# EAGLE design Serial_CAN_FD (EAGLE 6.4)
DESCRIPTION: microOBD 200 OBD-II Module; HW_REV: 1.4; PCB_REV: C; PCB_SPEC1: Layer Count: 4; PCB_SPEC2: Size: 1.3" x 0.59"; PCB_SPEC3: Finish Thickness: 0.049" - 0.052"; PCB_SPEC4: Copper Weight: 1oz; TITLE: STM1120

## Sheet 1 of 2
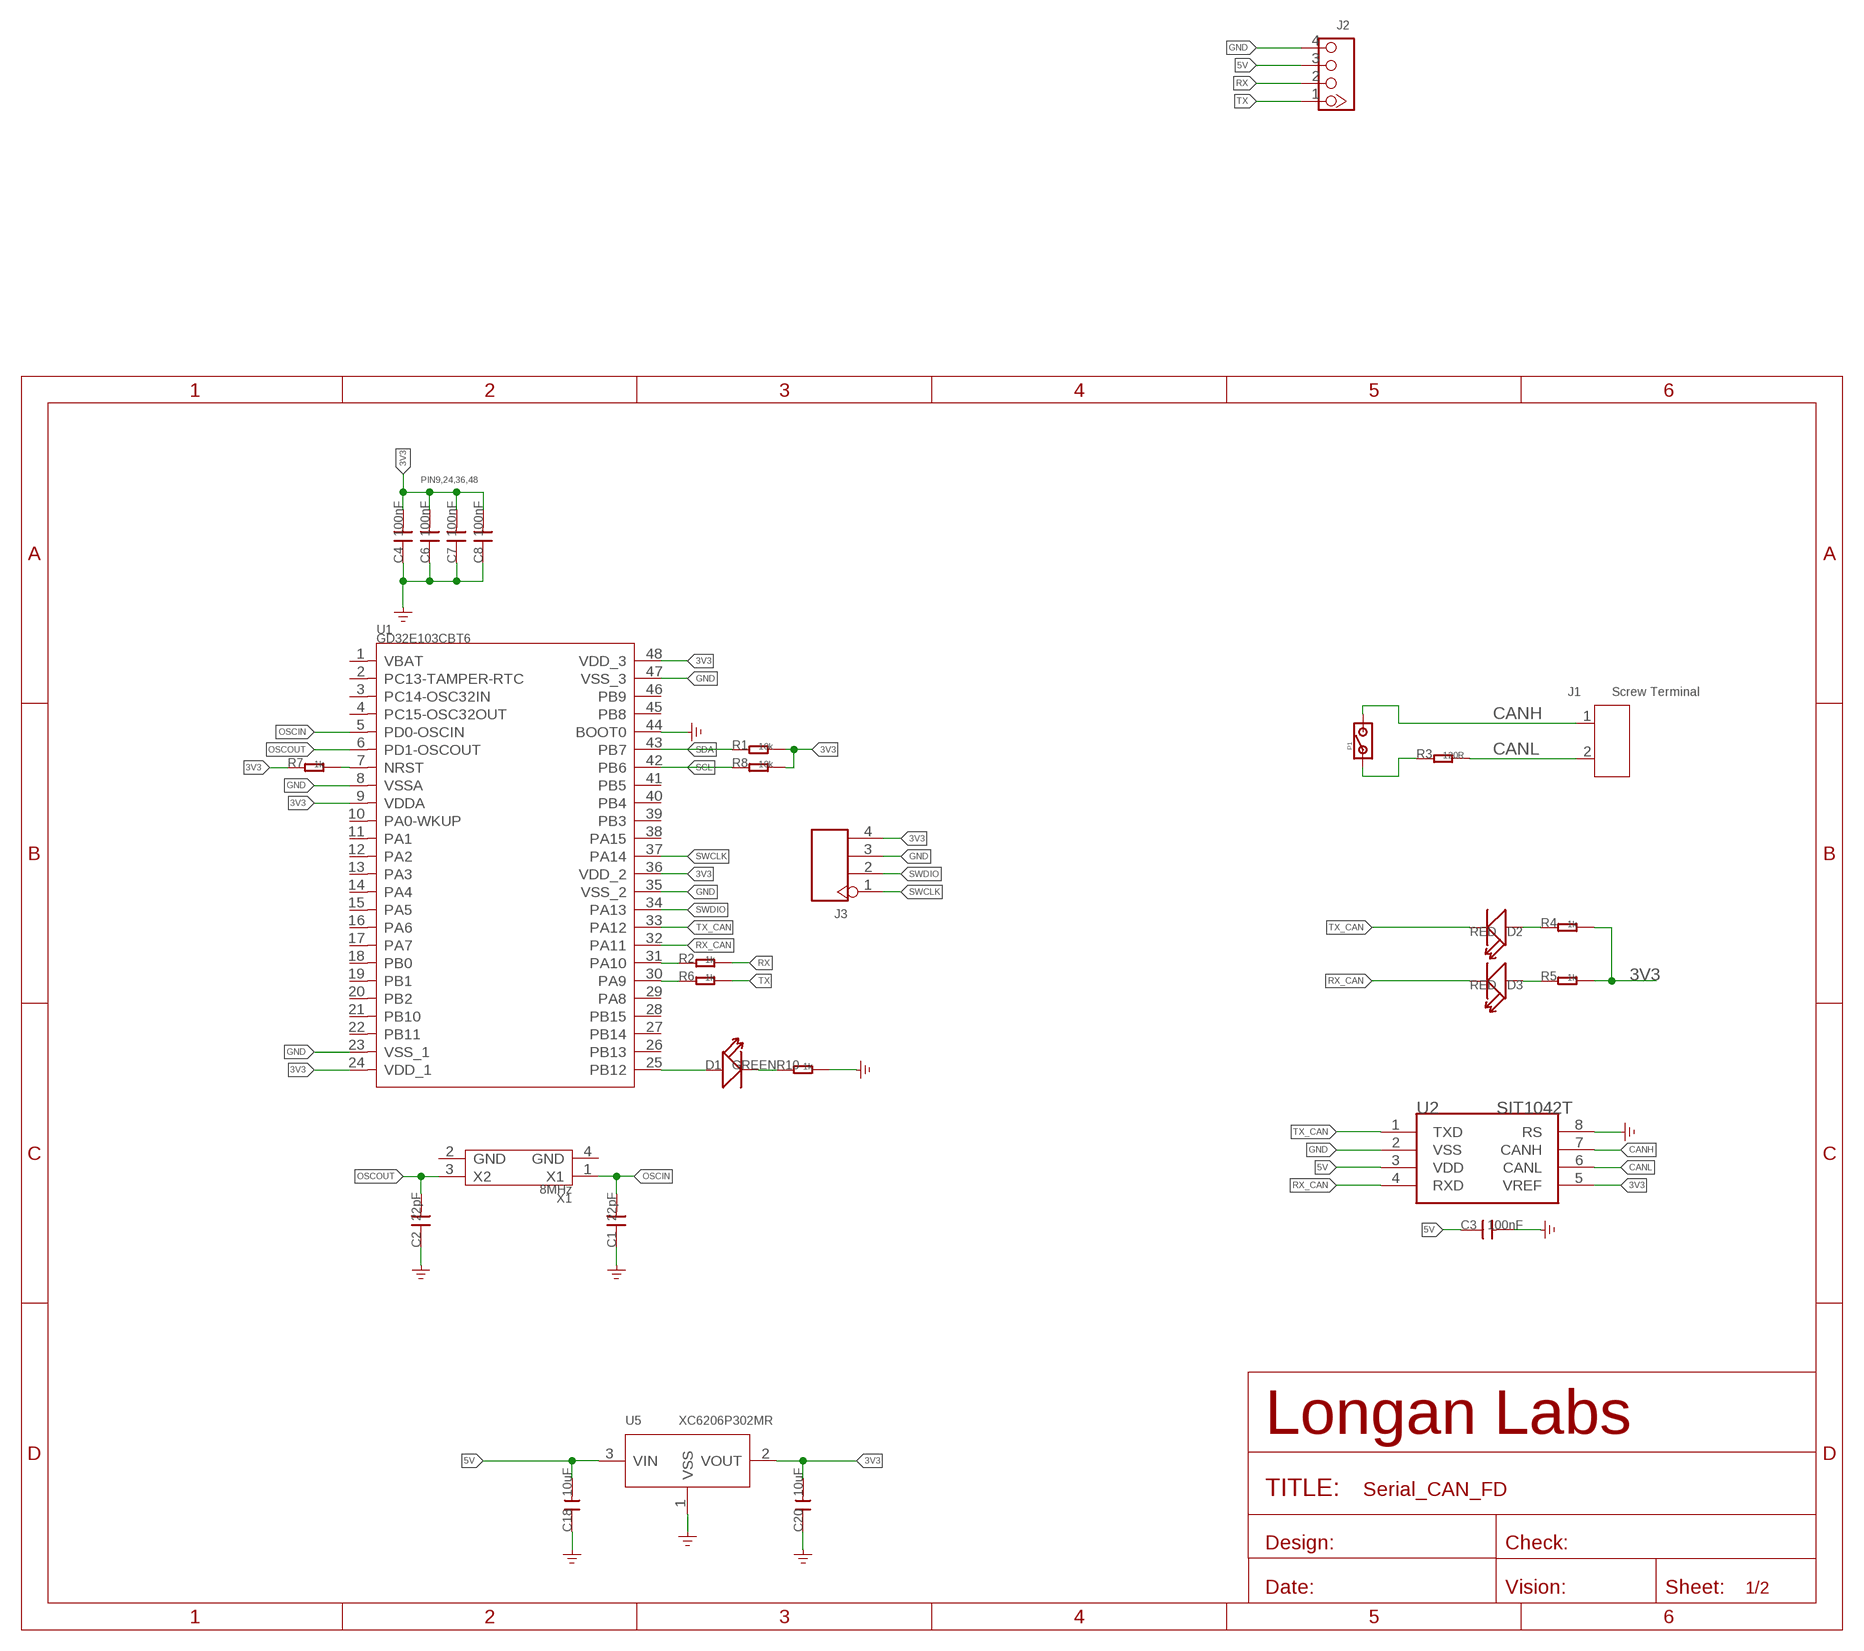
[diagram p0: schematic, sheet 1]

### Parts
C1  22pF  C-0603  [0603]
C2  22pF  C-0603  [0603]
C3  100nF  C-0603  [0603]
C4  100nF  C-0603  [0603]
C6  100nF  C-0603  [0603]
C7  100nF  C-0603  [0603]
C8  100nF  C-0603  [0603]
C18  10uF  CAP-0603  [C0603]
C20  10uF  CAP-0603  [C0603]
D1  GREEN  LED'0603'  [LED-0603]
D2  RED  LED'0603'  [LED-0603]
D3  RED  LED'0603'  [LED-0603]
J1  Screw Terminal  SCREW-TERMINAL-2P'3.5'  [2P-3.5]
J2  320110033  GROVE-CONNECTOR-DIP-320110033  [HW4-2.0]
J3  HEADER-4P-65/35MIL  [H4-2.54]
P1  PAD-JUMPER-2P  [2P-SMD-1.78X1.27]
R1  10k  R-0603  [0603]
R2  1k  R-0603  [0603]
R3  120R  R-0603  [0603]
R4  1k  R-0603  [0603]
R5  1k  R-0603  [0603]
R6  1k  R-0603  [0603]
R7  1k  R-0603  [0603]
R8  10k  R-0603  [0603]
R10  1k  R-0603  [0603]
U1  GD32E103CBT6  MCU-GD32E103CBT6  [LQFP48]
U2  SIT1042T  MCP2551-SOIC8  [SOIC8-6.0]
U5  XC6206P302MR  PMIC-XC6206PMR  [SOT-23]
X1  8MHz  CRYSTAL-4P-3225  [X4-SMD-3.2X2.5X0.7MM]

### Nets
3V3: C4.2 C6.2 C7.2 C8.2 C20.2 J3.4 R1.2 R4.2 R5.2 R7.1 R8.2 U1.9(VDDA) U1.24(VDD_1) U1.36(VDD_2) U1.48(VDD_3) U2.5(VREF) U5.2(VOUT)
5V: C3.1 C18.2 J2.3 U2.3(VDD) U5.3(VIN)
CANH: J1.1 P1.2 U2.7(CANH)
CANL: J1.2 R3.2 U2.6(CANL)
GND: C1.1 C2.1 C3.2 C4.1 C6.1 C7.1 C8.1 C18.1 C20.1 J2.4 J3.3 R10.2 U1.8(VSSA) U1.23(VSS_1) U1.35(VSS_2) U1.44(BOOT0) U1.47(VSS_3) U2.2(VSS) U2.8(RS) U5.1(VSS) ; supply symbol labelled GND_POWER
N$1: P1.1 R3.1
N$2: D2.+ R4.1
N$3: R2.1 U1.31(PA10)
N$4: R6.1 U1.30(PA9)
N$5: D1.+ U1.25(PB12)
N$6: R7.2 U1.7(NRST)
N$8: D1.- R10.1
N$15: D3.+ R5.1
OSCIN: C1.2 U1.5(PD0-OSCIN) X1.1(X1)
OSCOUT: C2.2 U1.6(PD1-OSCOUT) X1.3(X2)
RX: J2.2 R2.2
RX_CAN: D3.- U1.32(PA11) U2.4(RXD)
SCL: R8.1 U1.42(PB6)
SDA: R1.1 U1.43(PB7)
SWCLK: J3.1 U1.37(PA14)
SWDIO: J3.2 U1.34(PA13)
TX: J2.1 R6.2
TX_CAN: D2.- U1.33(PA12) U2.1(TXD)
Unconnected: U1.1(VBAT) U1.2(PC13-TAMPER-RTC) U1.3(PC14-OSC32IN) U1.4(PC15-OSC32OUT) U1.10(PA0-WKUP) U1.11(PA1) U1.12(PA2) U1.13(PA3) U1.14(PA4) U1.15(PA5) U1.16(PA6) U1.17(PA7) U1.18(PB0) U1.19(PB1) U1.20(PB2) U1.21(PB10) U1.22(PB11) U1.26(PB13) U1.27(PB14) U1.28(PB15) U1.29(PA8) U1.38(PA15) U1.39(PB3) U1.40(PB4) U1.41(PB5) U1.45(PB8) U1.46(PB9) X1.2(GND) X1.4(GND)

### Notes on the sheet
- PIN9,24,36,48

## Sheet 2 of 2

## Library data of the parts
C1-C4 C6-C8 = Discrete:C*: Ceramic Capacitors
C18 C20 = Discrete-new:CAP: Ceramic Capacitors
D1-D3 = Discrete:LED*
J1 = Connector-new:SCREW-TERMINAL-2P: 2P-3.5:320110028;2P-5.0:320110031
J2 = Connector-new:GROVE-CONNECTOR-DIP
J3 = Connector-new:HEADER-4P
P1 = Discrete:PAD-JUMPER-2P
R1-R8 R10 = Discrete:R*
U1 = Longan-IC:MCU-GD32E103CBT6
U2 = IC:MCP2551: High-Speed CAN Transceiver http://ww1.microchip.com/downloads/en/devicedoc/21667f.pdf
U5 = IC-new:PMIC-XC6206P: LOW ESR Cap.Compatible Positive Voltage Regulators
X1 = Discrete-new:CRYSTAL-4P

## Net classes
3 usbvcc: width 0.152 mm, drill 0.152 mm, clearance 0.152 mm

## Board
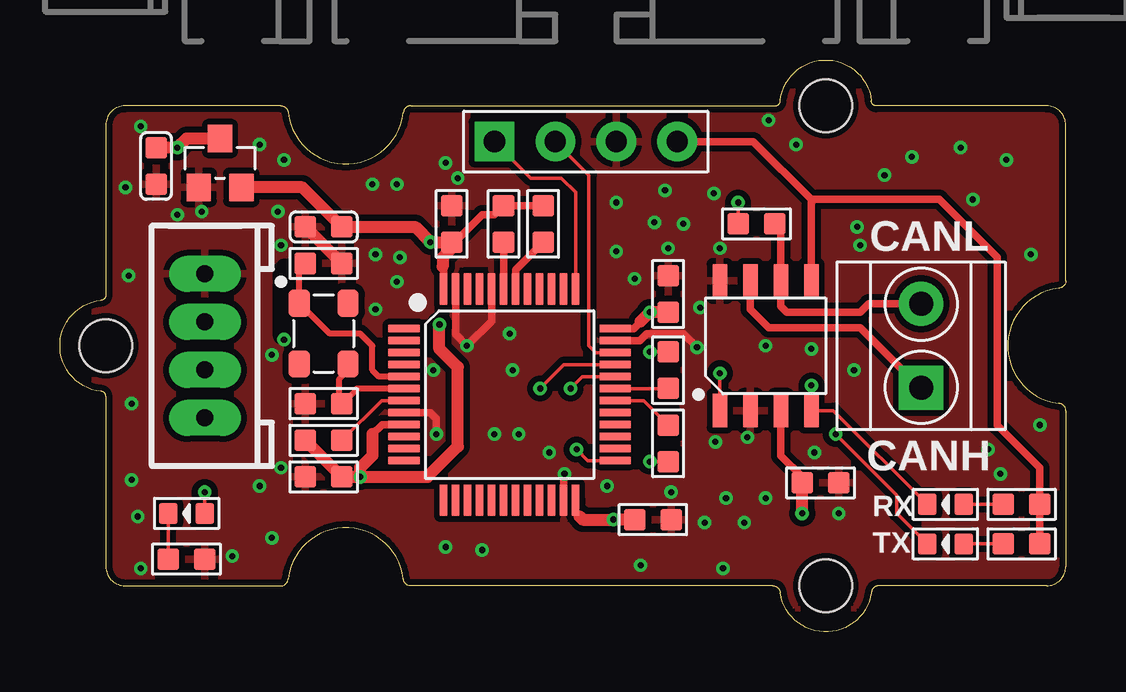
[diagram p1: board, top side]
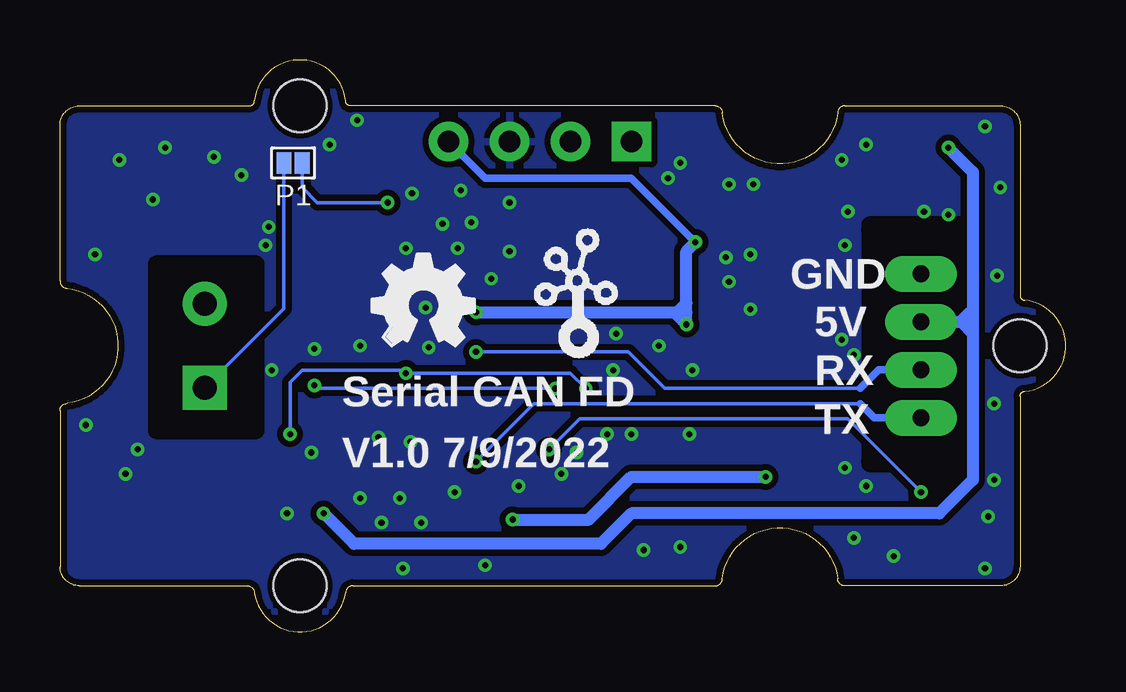
[diagram p2: board, bottom side, seen from below]

Size 41.91 x 23.83 mm. Coordinates in mm from the lower left corner, seen from the top.
Copper layers (1*16): Top 0.035mm / dielectric 1.5mm / Bottom 0.035mm
Design rules "SeeedStudio_2layer_DRU_no_angle_20140221 *": minimum track width 6mil, minimum drill 10mil, track to track 6mil, track to pad 6mil, pad to pad 6mil, via to via 6mil, smd to smd 0mil, copper to edge 10mil, drill to drill 10mil, minimum pad ring 10mil, minimum via ring 6mil, stop-mask expansion 2mil, vias tented up to drill 25mil, thermal gap 10mil
tRestrict: area 9.2,12.3 to 9.8,15.2
bRestrict: area 4,7.1 to 8.2,16.7; area 33.7,8.4 to 37.9,15.4

### Footprints (pad centres in the part's own frame; a part is rotated, then mirrored left to right if it is on the bottom)
0603 = smd 0.889 x 0.889: 1 -0.762,0; 2 0.762,0
C0603 = smd 0.889 x 0.889: 1 -0.762,0; 2 0.762,0
LED-0603 = smd 0.762 x 0.889: + -0.762,0; - 0.762,0
2P-3.5 = drill 1 pad 1.85 square: 1 -1.75,0 | drill 1 pad 1.85: 2 1.75,0
HW4-2.0 = drill 0.7 pad 1.5 long: 1 -3,0; 2 -1,0; 3 1,0; 4 3,0
H4-2.54 = drill 0.889 pad 1.651 square: 1 0,3.81 | drill 0.889 pad 1.651: 2 0,1.27; 3 0,-1.27; 4 0,-3.81
2P-SMD-1.78X1.27 = smd 0.889 x 0.61: 1 0,0.381; 2 0,-0.381
LQFP48 = smd 1.3 x 0.3: 1 -4.4,2.75; 2 -4.4,2.25; 3 -4.4,1.75; 4 -4.4,1.25; 5 -4.4,0.75; 6 -4.4,0.25; 7 -4.4,-0.25; 8 -4.4,-0.75; 9 -4.4,-1.25; 10 -4.4,-1.75; 11 -4.4,-2.25; 12 -4.4,-2.75; 25 4.4,-2.75; 26 4.4,-2.25; 27 4.4,-1.75; 28 4.4,-1.25; 29 4.4,-0.75; 30 4.4,-0.25; 31 4.4,0.25; 32 4.4,0.75; 33 4.4,1.25; 34 4.4,1.75; 35 4.4,2.25; 36 4.4,2.75 | smd 0.3 x 1.3: 13 -2.75,-4.4; 14 -2.25,-4.4; 15 -1.75,-4.4; 16 -1.25,-4.4; 17 -0.75,-4.4; 18 -0.25,-4.4; 19 0.25,-4.4; 20 0.75,-4.4; 21 1.25,-4.4; 22 1.75,-4.4; 23 2.25,-4.4; 24 2.75,-4.4; 37 2.75,4.4; 38 2.25,4.4; 39 1.75,4.4; 40 1.25,4.4; 41 0.75,4.4; 42 0.25,4.4; 43 -0.25,4.4; 44 -0.75,4.4; 45 -1.25,4.4; 46 -1.75,4.4; 47 -2.25,4.4; 48 -2.75,4.4
SOIC8-6.0 = smd 0.6 x 1.4: 1 -1.905,-2.7; 2 -0.635,-2.7; 3 0.635,-2.7; 4 1.905,-2.7; 5 1.905,2.7; 6 0.635,2.7; 7 -0.635,2.7; 8 -1.905,2.7
GROVE-TEST-PLATFORM = hole 2.2: -10,-10; -10,10; 20,0
SOT-23 = smd 1.016 x 1.143: 1 -0.889,-1.016; 2 0.889,-1.016; 3 0,1.016
X4-SMD-3.2X2.5X0.7MM = smd 1.143 x 0.889: 1 -1.27,-1.016; 2 1.27,-1.016; 3 1.27,1.016; 4 -1.27,1.016

### Placement (x,y rotation side)
C1  10.99,15.35 180 top
C2  10.99,9.51 0 top
C3  31.69,6.21 0 top
C4  10.99,6.46 0 top
C6  24.7,4.68 180 top
C7  25.34,14.08 270 top
C8  16.32,17 270 top
C18  4,19.41 90 top
C20  10.99,16.87 0 top
D1  5.27,4.94 180 top
D2  36.89,3.67 180 top
D3  36.89,5.32 180 top
J1  35.88,11.92 90 top
J2  6.03,11.92 90 top
J3  21.91,20.43 90 top
P1  32.2,19.54 270 bottom
R1  18.48,17 90 top
R2  25.34,10.91 90 top
R3  29.02,17 0 top
R4  40.07,3.67 0 top
R5  40.07,5.32 0 top
R6  25.34,7.86 270 top
R7  10.99,7.98 0 top
R8  20.13,17 90 top
R10  5.27,3.03 0 top
U1  18.73,9.89 0 top
U2  29.4,11.92 0 top
U3  [GROVE-TEST-PLATFORM]  21.91,11.92 180 top
U5  6.67,19.54 0 top
U$5  [OSHW_FILLX150_NOTEXT]  28.89,11.92 0 bottom
U$9  [GROVE-SILK-SMALL]  22.54,11.29 0 bottom
X1  10.99,12.43 270 top

### Tracks (layer width: path | path; a pad name or v marks a point on that pad's centre or on a via)
3V3  (via drill 0.25 pad 0.51)
  Top 0.305: R4.2 R5.2 40.83,6.84 39.05,8.62 39.05,15.6 36.64,18.02 31.43,18.02 31.31,17.89 | U1.9 13.42,8.64 13.02,8.24 | U1.48 15.98,15.18 15.94,15.22 | U1.36 23.9,12.64 24.19,12.94 | U1.24 21.48,4.98 21.65,4.81 | 16.45,16.24 17.59,17.38 18.1,17.38 R1.2 R8.2 | U2.5 31.31,17.89 | 31.31,17.89 31.31,18.02 28.89,20.43 J3.4
  Top 0.508: 13.02,8.24 13.02,7.35 12.51,6.84 v12.51,6.46 | v12.51,6.46 C4.2 R7.1 | C8.2 16.32,15.99 15.94,15.6 15.94,15.22 | C8.2 16.45,16.24 | C8.2 v15.43,16.24 14.8,16.87 13.78,16.87 C20.2 10.1,18.53 U5.2 | 24.19,12.94 v24.58,13.32 C7.2 | 21.65,4.81 21.78,4.68 v23.05,4.68 C6.2 | v12.51,6.46 15.3,6.46 16.57,7.73 16.57,11.03 15.81,11.79 v15.81,12.81
  Bottom 0.305: J3.4 24.19,18.91 18.1,18.91 v15.43,16.24
  Bottom 0.508: v24.58,13.32 16.32,13.32 | 16.19,13.32 15.81,13.32 | 15.81,13.32 v15.81,12.81 16.32,13.32 | 15.81,13.32 15.81,13.7 | 15.81,13.7 15.81,15.86 v15.43,16.24 | 16.32,13.32 16.19,13.32 | 16.19,13.32 15.81,13.7 | v23.05,4.68 19.88,4.68 18.1,6.46 v12.51,6.46
5V  (via drill 0.25 pad 0.51)
  Top 0.305: C3.1 30.93,6.46 30.04,7.35 U2.3
  Top 0.508: C18.2 v4.89,20.18 5.27,20.56 U5.3 | v30.93,4.94 C3.1
  Bottom 0.508: J2.3 5.84,12.92 4.4,12.92 | v4.89,20.18 3.87,19.16 3.87,12.43 | 4.4,12.92 4,13.32 | 3.87,12.43 3.87,6.33 5.27,4.94 18.1,4.94 19.37,3.67 29.66,3.67 v30.93,4.94 | 4.4,12.92 4.37,12.92 3.87,12.43
CANH
  Top 0.305: J1.1 35.85,10.17 33.34,12.68 29.53,12.68 28.77,13.45 U2.7
  Bottom 0.152: P1.2 32.58,13.47 J1.1
CANL
  Top 0.305: J1.2 33.69,13.67 33.34,13.32 30.29,13.32 30.04,13.57 U2.6 30.04,16.75 R3.2
GND  (via drill 0.25 pad 0.51)
  Top 0.305: U1.35 24.16,12.14 24.45,12.43 25.97,12.43 v26.54,11.86 | U1.47 16.48,12.39 v16.96,11.92 17.98,12.95 U1.44 | U1.23 20.98,6.55 v21.02,6.59 | U1.8 15.42,9.14 15.69,8.87 v15.69,8.24
  Top 0.508: C1.1 C20.1
  other vias: 14.03,14.59 33.08,10.91 40.83,8.62 40.45,15.73 27.24,18.27 3.24,4.81 7.18,3.16 27.62,2.65 2.99,6.33 3.37,2.65 38.67,7.6 4.89,17.38 31.43,7.48 5.91,17.51 33.34,16.11 33.21,16.87 26.86,4.56 28.64,8.11 32.45,4.94 24.19,2.78 17.59,3.41 16.07,3.54 8.32,6.08 9.21,6.84 8.83,11.54 9.34,12.18 9.21,16.11 9.08,17.51 13.02,18.65 14.16,15.6 13.15,13.45 27.75,5.57 18.86,10.91 19.11,8.24 18.1,8.24 37.53,20.18 18.73,12.43 23.18,15.86 25.34,15.99 25.21,18.4 16.57,18.91 16.07,19.54 24.77,17.06 27.31,7.92 20.38,7.48 15.56,10.91 22.8,6.08 2.99,9.51 2.86,14.84 2.73,18.53 3.37,21.07 8.32,20.3 9.34,19.67 14.03,18.65 23.18,17.89 25.97,17 27.5,15.99 31.31,11.79 34.35,19.03 38.04,18.02 39.43,19.67 35.5,19.8 29.4,11.92 28.51,4.56 30.67,20.3 29.53,21.32 29.4,5.57 13.15,15.73 23.94,14.72 25.46,5.83 39.18,6.59 8.83,3.92 26.67,13.51
  pour Bottom (isolate 0.254): -0.32,-0.14 42.23,-0.14 42.23,23.99 -0.32,23.99
  pour Top (isolate 0.254): -0.32,-0.14 42.23,-0.14 42.23,23.99 -0.32,23.99
N$1  (via drill 0.25 pad 0.51)
  Top 0.152: R3.1 v28.26,17.89
  Bottom 0.152: v28.26,17.89 31.18,17.89 31.81,18.53 P1.1
N$2
  Top 0.152: D2.+ R4.1
N$3
  Top 0.152: U1.31 R2.1
N$4
  Top 0.152: U1.30 24.32,9.64 R6.1
N$5  (via drill 0.25 pad 0.51)
  Top 0.152: U1.25 21.99,7.14 v21.53,7.6 | v6.03,5.83 D1.+
  Bottom 0.152: v21.53,7.6 20.26,8.87 9.08,8.87 v6.03,5.83
N$6
  Top 0.152: U1.7 13.4,9.64 R7.2
N$8
  Top 0.152: R10.1 D1.-
N$15
  Top 0.152: D3.+ R5.1
OSCIN
  Top 0.254: U1.5 13.28,10.64 13.02,10.91 13.02,11.92 12.51,12.43 11.24,12.43 X1.1 9.97,15.1 C1.2
OSCOUT
  Top 0.254: U1.6 12.38,10.14 C2.2 11.62,9.64 11.62,10.52 12,10.91 X1.3
RX  (via drill 0.25 pad 0.51)
  Top 0.152: R2.2 v24.58,11.67
  Bottom 0.152: 8.57,10.14 16.7,10.14 18.23,11.67 v24.58,11.67
  Bottom 0.305: J2.2 7.8,10.92 8.57,10.14
RX_CAN  (via drill 0.25 pad 0.51)
  Top 0.152: U2.4 31.43,9.22 | 31.43,9.22 32.23,9.22 D3.- | U1.32 21.77,10.64 v21.27,10.14 | v31.31,10.27 31.31,9.25 31.4,9.25 31.43,9.22
  Bottom 0.152: v21.27,10.14 31.18,10.14 v31.31,10.27
SCL
  Top 0.305: U1.42 18.98,15.09 R8.1
SDA
  Top 0.305: U1.43 R1.1
SWCLK
  Top 0.152: U1.37 21.48,18.32 20.89,18.91 19.62,18.91 J3.1
SWDIO
  Top 0.152: U1.34 22.32,11.64 22.04,11.92 22.04,19.03 J3.2
TX  (via drill 0.25 pad 0.51)
  Top 0.152: R6.2 v24.58,7.1
  Bottom 0.152: 8.57,9.51 22.16,9.51 v24.58,7.1
  Bottom 0.305: J2.1 7.99,8.92 8.57,9.51
TX_CAN  (via drill 0.25 pad 0.51)
  Top 0.152: U1.33 21,11.14 v20,10.14 | U2.1 v27.5,10.78 | D2.- 34.86,4.94 34.86,5.7 v32.32,8.24
  Bottom 0.152: v20,10.14 20.64,10.78 v27.5,10.78 27.62,10.91 31.81,10.91 32.32,10.4 v32.32,8.24

### Text on the board
tPlace: CANL | CANH | RX | TX
bPlace: P1 | GND | 5V | RX | Serial CAN FD | TX | V1.0 7/9/2022